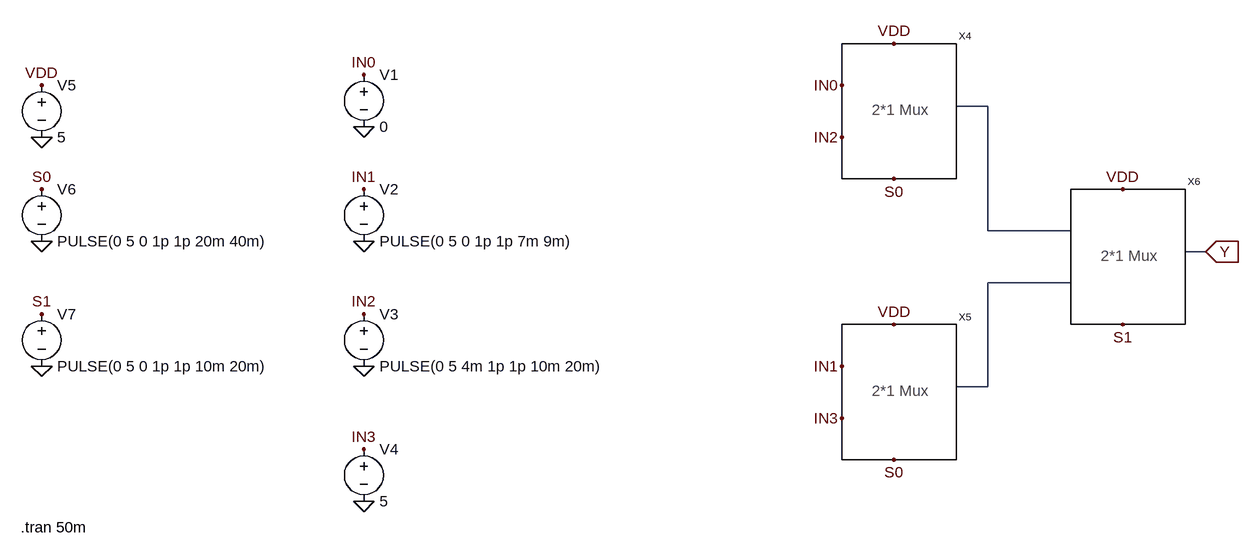
[diagram p0: schematic CASCADED_MUX_PTL.asc]
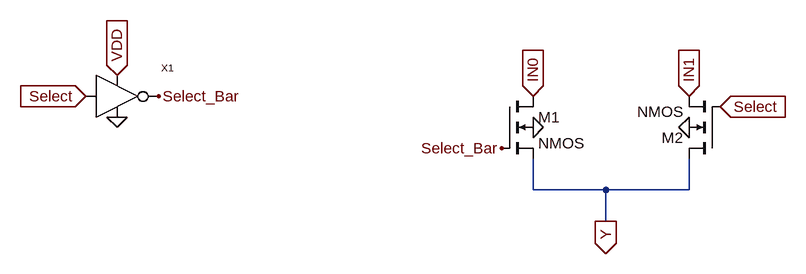
[diagram p1: sub-circuit mux_ptl.asc]
CASCADED_MUX_PTL.asc, the LTspice schematic file:
Version 4
SHEET 1 1068 680
WIRE 656 -192 608 -192
WIRE 656 0 656 -192
WIRE 784 0 656 0
WIRE 992 32 960 32
WIRE 784 80 656 80
WIRE 656 240 656 80
WIRE 656 240 608 240
FLAG -304 -240 IN0
FLAG -304 -64 IN1
FLAG -304 128 IN2
FLAG -304 336 IN3
FLAG -304 -160 0
FLAG -304 16 0
FLAG -304 208 0
FLAG -304 416 0
FLAG -800 208 0
FLAG -800 16 0
FLAG -800 -144 0
FLAG -800 -224 VDD
FLAG -800 -64 S0
FLAG -800 128 S1
FLAG 512 -288 VDD
FLAG 512 144 VDD
FLAG 864 -64 VDD
FLAG 432 -224 IN0
FLAG 432 208 IN1
FLAG 432 -144 IN2
FLAG 432 288 IN3
FLAG 512 -80 S0
FLAG 512 352 S0
FLAG 864 144 S1
FLAG 992 32 Y
IOPIN 992 32 In
SYMBOL voltage -304 -256 R0
WINDOW 123 0 0 Left 0
WINDOW 39 0 0 Left 0
SYMATTR InstName V1
SYMATTR Value 0
SYMBOL voltage -304 -80 R0
WINDOW 123 0 0 Left 0
WINDOW 39 0 0 Left 0
SYMATTR InstName V2
SYMATTR Value PULSE(0 5 0 1p 1p 7m 9m)
SYMBOL voltage -304 112 R0
WINDOW 123 0 0 Left 0
WINDOW 39 0 0 Left 0
SYMATTR InstName V3
SYMATTR Value PULSE(0 5 4m 1p 1p 10m 20m)
SYMBOL voltage -304 320 R0
WINDOW 123 0 0 Left 0
WINDOW 39 0 0 Left 0
SYMATTR InstName V4
SYMATTR Value 5
SYMBOL voltage -800 -240 R0
WINDOW 123 0 0 Left 0
WINDOW 39 0 0 Left 0
SYMATTR InstName V5
SYMATTR Value 5
SYMBOL voltage -800 -80 R0
WINDOW 123 0 0 Left 0
WINDOW 39 0 0 Left 0
SYMATTR InstName V6
SYMATTR Value PULSE(0 5 0 1p 1p 20m 40m)
SYMBOL voltage -800 112 R0
WINDOW 123 0 0 Left 0
WINDOW 39 0 0 Left 0
SYMATTR InstName V7
SYMATTR Value PULSE(0 5 0 1p 1p 10m 20m)
SYMBOL MUX_PTL 432 -224 R0
SYMATTR InstName X4
SYMBOL MUX_PTL 432 208 R0
SYMATTR InstName X5
SYMBOL MUX_PTL 784 0 R0
SYMATTR InstName X6
TEXT -832 456 Left 2 !.tran 50m

mux_ptl.asc, the sub-circuit schematic file:
Version 4
SHEET 1 1428 680
WIRE 912 160 912 112
WIRE 1024 160 912 160
WIRE 1152 160 1152 112
WIRE 1152 160 1024 160
WIRE 1024 208 1024 160
FLAG 912 16 IN0
IOPIN 912 16 In
FLAG 1152 16 IN1
IOPIN 1152 16 In
FLAG 272 -16 VDD
IOPIN 272 -16 In
FLAG 272 48 0
FLAG 336 16 Select_Bar
FLAG 224 16 Select
IOPIN 224 16 In
FLAG 1200 32 Select
IOPIN 1200 32 In
FLAG 864 96 Select_Bar
FLAG 912 64 0
FLAG 1152 64 0
FLAG 1024 208 Y
IOPIN 1024 208 Out
SYMBOL nmos4 864 16 R0
SYMATTR InstName M1
SYMBOL nmos4 1200 112 R180
SYMATTR InstName M2
SYMBOL CMOS_Inverter 240 48 R0
SYMATTR InstName X1

The netlist it stands for:
* CASCADED_MUX_PTL.asc
V1 IN0 0 0
V2 IN1 0 PULSE(0 5 0 1p 1p 7m 9m)
V3 IN2 0 PULSE(0 5 4m 1p 1p 10m 20m)
V4 IN3 0 5
V5 VDD 0 5
V6 S0 0 PULSE(0 5 0 1p 1p 20m 40m)
V7 S1 0 PULSE(0 5 0 1p 1p 10m 20m)
XX4 IN0 IN2 VDD N001 S0 mux_ptl
XX5 IN1 IN3 VDD N002 S0 mux_ptl
XX6 N001 N002 VDD Y S1 mux_ptl

* block symbol definitions
.subckt mux_ptl IN0 IN1 VDD Y Select
M1 IN0 Select_Bar Y 0 NMOS
M2 Y Select IN1 0 NMOS
XX1 VDD 0 Select Select_Bar CMOS_Inverter  ; pins VPOS VNEG VIN VOUT
.ends mux_ptl

.model NMOS NMOS
.model PMOS PMOS
.lib standard.mos
.tran 50m
.backanno
.end